# EAGLE design almo (EAGLE 9.4.2)
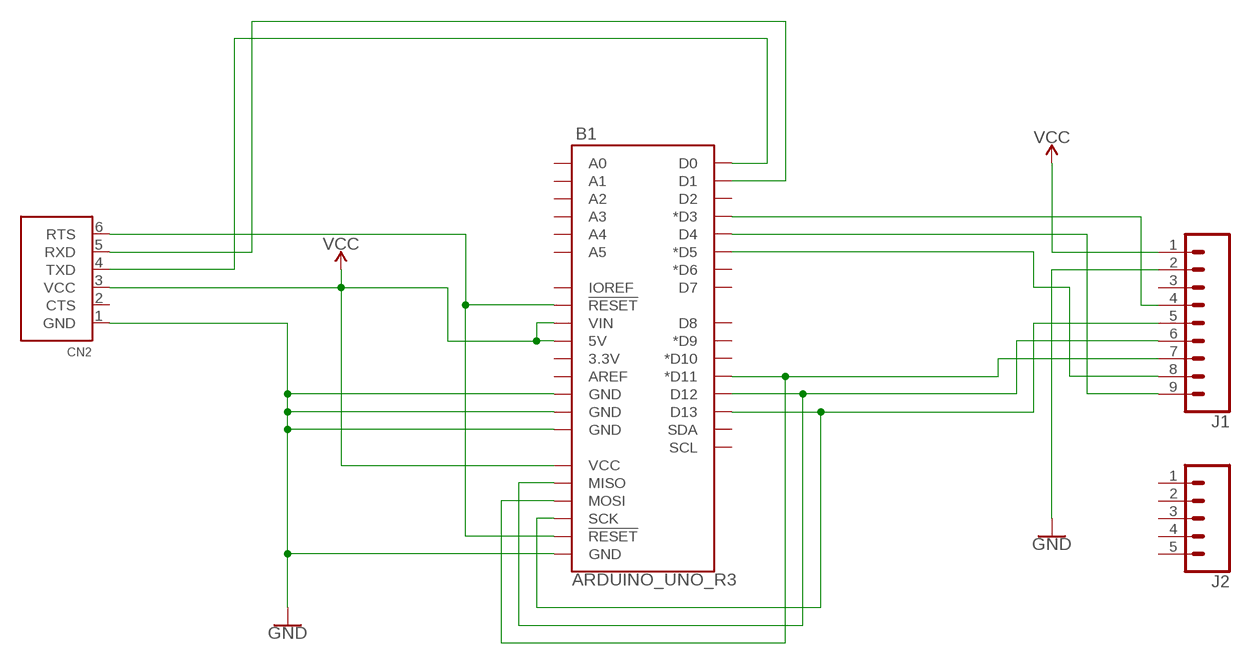
[diagram p0: schematic, sheet 1]

## Parts
B1  ARDUINO_UNO_R3  [ARDUINO_R3]
CN2  FTDIUSBCABLE  [1X06_ROUND]
J1  CONN_09  [1X09]
J2  CONN_05  [1X05]

## Nets
GND: B1.GND@1(GND) B1.GND@2(GND) B1.GND@3(GND) B1.GND@4(GND) CN2.1(GND) J1.2
N$2: B1.D13 B1.SCK J1.5
N$3: B1.RESET@1(!RESET!) B1.RESET@2(!RESET!) CN2.6(RTS)
N$4: B1.D1 CN2.5(RXD)
N$5: B1.D0 CN2.4(TXD)
N$6: B1.D12 B1.MISO J1.6
N$7: B1.D11(*D11) B1.MOSI J1.7
N$8: B1.D5(*D5) J1.8
N$9: B1.D4 J1.9
N$10: B1.D3(*D3) J1.4
VCC: B1.5V B1.VCC B1.VIN CN2.3(VCC) J1.1
Unconnected: B1.3.3V B1.A0 B1.A1 B1.A2 B1.A3 B1.A4 B1.A5 B1.AREF B1.D2 B1.D6(*D6) B1.D7 B1.D8 B1.D9(*D9) B1.D10(*D10) B1.IOREF B1.SCL B1.SDA CN2.2(CTS) J1.3 J2.1 J2.2 J2.3 J2.4 J2.5

## Library data of the parts
B1 = SparkFun-Boards:ARDUINO_UNO_R3: Arduino R3 Footprint with SPI header Arduino Uno R3 Compatible Footprint. Matches PCB size of the original board. SparkFun Products: SAMD21 Dev Breakout <https://www.sparkfun.com/products/13672> RedBoard <https://www.sparkfun.com/products/12757> R3 Stackable Headers <https://www.sparkfun.com/products/11417>
CN2 = microbuilder:FTDIUSBCABLE: FTDI TTL-232R USB Cable Connector for FTDI's USB->RS232 Cable
J1 = SparkFun-Connectors:CONN_09: Multi connection point. Often used as Generic Header-pin footprint for 0.1 inch spaced/style header connections On any of the 0.1 inch spaced packages, you can populate with these: Break Away Headers - Straight <https://www.sparkfun.com/products/116> (PRT-00116) Break Away Male Headers - Right Angle <https://www.sparkfun.com/products/553> (PRT-00553) Female Headers <https://www.sparkfun.com/products/115> (PRT-00115) Break Away Headers - Machine Pin <https://www.sparkfun.com/products/117> (PRT-00117) Break Away Female Headers - Swiss Machine Pin <https://www.sparkfun.com/products/743> (PRT-00743) For SCREWTERMINALS and SPRING TERMINALS visit here: Screw Terimnals on SparkFun.com <https://www.sparkfun.com/search/results?term=Screw+Terminals> (5mm/3.5mm/2.54mm spacing) This device is also useful as a general connection point to wire up your design to another part of your project. Our various solder wires solder well into these plated through hole pads. Hook-Up Wire - Assortment (Stranded, 22 AWG) <https://www.sparkfun.com/products/11375> (PRT-11375) Hook-Up Wire - Assortment (Solid Core, 22 AWG) <https://www.sparkfun.com/products/11367> (PRT-11367) View the entire wire category on our website here <https://www.sparkfun.com/categories/141> Special notes: Molex polarized connector foot print use with SKU : PRT-08231 with associated crimp pins and housings. 1MM SMD Version SKU: PRT-10208 NOTES ON THE VARIANTS LOCK and LOCK_LONGPADS... This footprint was designed to help hold the alignment of a through-hole component (i.e. 6-pin header) while soldering it into place. You may notice that each hole has been shifted either up or down by 0.005 of an inch from it's more standard position (which is a perfectly straight line). This slight alteration caused the pins (the squares in the middle) to touch the edges of the holes. Because they are alternating, it causes a "brace" to hold the component in place. 0.005 has proven to be the perfect amount of "off-center" position when using our standard breakaway headers. Although looks a little odd when you look at the bare footprint, once you have a header in there, the alteration is very hard to notice. Also,if you push a header all the way into place, it is covered up entirely on the bottom side.
J2 = SparkFun-Connectors:CONN_05: Multi connection point. Often used as Generic Header-pin footprint for 0.1 inch spaced/style header connections On any of the 0.1 inch spaced packages, you can populate with these: Break Away Headers - Straight <https://www.sparkfun.com/products/116> (PRT-00116) Break Away Male Headers - Right Angle <https://www.sparkfun.com/products/553> (PRT-00553) Female Headers <https://www.sparkfun.com/products/115> (PRT-00115) Break Away Headers - Machine Pin <https://www.sparkfun.com/products/117> (PRT-00117) Break Away Female Headers - Swiss Machine Pin <https://www.sparkfun.com/products/743> (PRT-00743) For SCREWTERMINALS and SPRING TERMINALS visit here: Screw Terimnals on SparkFun.com <https://www.sparkfun.com/search/results?term=Screw+Terminals> (5mm/3.5mm/2.54mm spacing) This device is also useful as a general connection point to wire up your design to another part of your project. Our various solder wires solder well into these plated through hole pads. Hook-Up Wire - Assortment (Stranded, 22 AWG) <https://www.sparkfun.com/products/11375> (PRT-11375) Hook-Up Wire - Assortment (Solid Core, 22 AWG) <https://www.sparkfun.com/products/11367> (PRT-11367) View the entire wire category on our website here <https://www.sparkfun.com/categories/141> Special notes: Molex polarized connector foot print use with SKU : PRT-08231 with associated crimp pins and housings. 1MM SMD Version SKU: PRT-10208

## Net classes
0 default: width 0.254 mm, drill 0.508 mm, clearance 0.254 mm

## Board
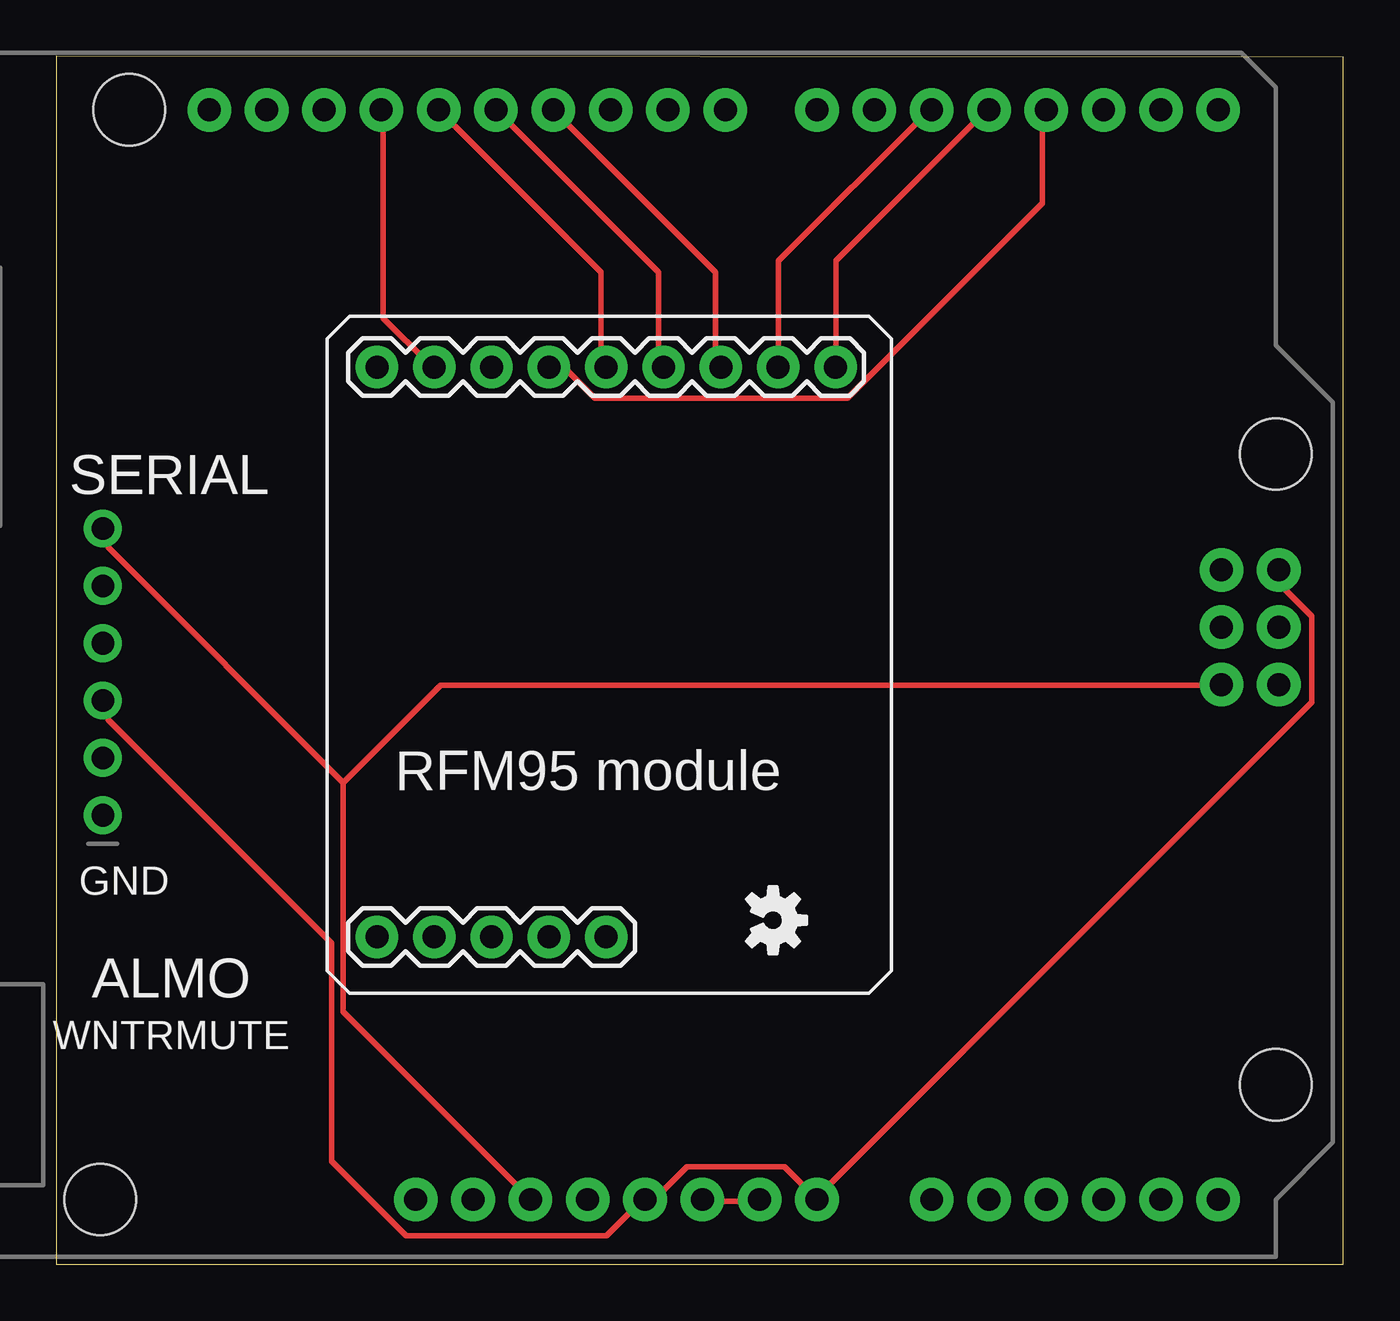
[diagram p1: board, top side]
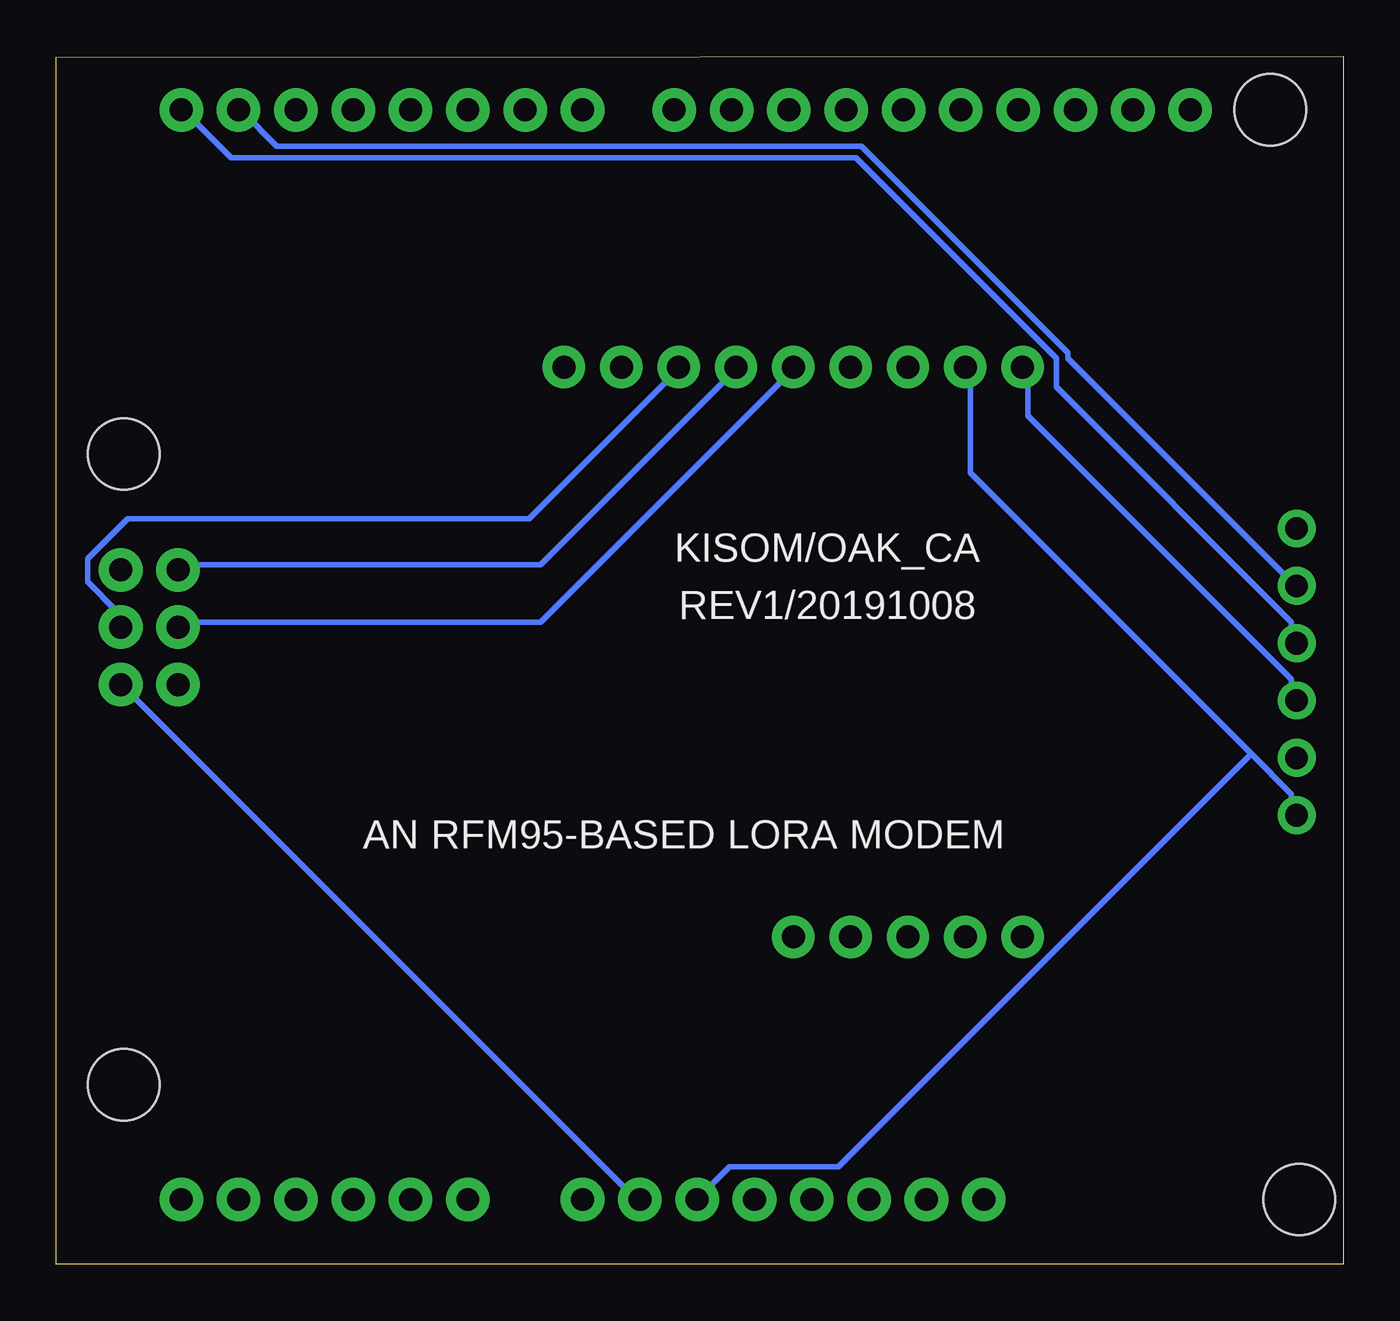
[diagram p2: board, bottom side, seen from below]

Size 57.01 x 53.5 mm. Coordinates in mm from the lower left corner, seen from the top.
Outline: 0,0 57.01,0 57.01,53.46 0,53.5 0,0
Copper layers (1*16): Top 0.035mm / dielectric 1.5mm / Bottom 0.035mm
Design rules "default": minimum track width 6mil, minimum drill 0.35mm, track to track 6mil, track to pad 6mil, pad to pad 6mil, via to via 6mil, smd to smd 6mil, copper to edge 40mil, drill to drill 6mil, minimum pad ring 10mil, minimum via ring 8mil, stop-mask expansion 4mil, vias tented up to drill 0mil, thermal gap 10mil

### Footprints (pad centres in the part's own frame; a part is rotated, then mirrored left to right if it is on the bottom)
ARDUINO_R3 = drill 1.016 pad 1.93: 3.3V 2.54,-24.13; 5V 5.08,-24.13; A0 17.78,-24.13; A1 20.32,-24.13; A2 22.86,-24.13; A3 25.4,-24.13; A4 27.94,-24.13; A5 30.48,-24.13; AREF -9.144,24.13; D0 30.48,24.13; D1 27.94,24.13; D2 25.4,24.13; D3 22.86,24.13; D4 20.32,24.13; D5 17.78,24.13; D6 15.24,24.13; D7 12.7,24.13; D8 8.636,24.13; D9 6.096,24.13; D10 3.556,24.13; D11 1.016,24.13; D12 -1.524,24.13; D13 -4.064,24.13; GND@1 7.62,-24.13; GND@2 10.16,-24.13; GND@3 -6.604,24.13; GND@4 33.16,-1.32; IOREF -2.54,-24.13; MISO 30.62,3.76; MOSI 33.16,1.22; NC -5.08,-24.13; RESET@1 0,-24.13; RESET@2 30.62,-1.32; SCK 30.62,1.22; SCL -14.224,24.13; SDA -11.684,24.13; VCC 33.16,3.76; VIN 12.7,-24.13 | hole 3.175: -17.78,24.13; 33.02,8.89; 33.02,-19.05; -19.05,-24.13
1X06_ROUND = drill 1 pad 1.676: 1 -6.35,0; 2 -3.81,0; 3 -1.27,0; 4 1.27,0; 5 3.81,0; 6 6.35,0
1X09 = drill 1.016 pad 1.88: 1 0,0; 2 2.54,0; 3 5.08,0; 4 7.62,0; 5 10.16,0; 6 12.7,0; 7 15.24,0; 8 17.78,0; 9 20.32,0
1X05 = drill 1.016 pad 1.88: 1 0,0; 2 2.54,0; 3 5.08,0; 4 7.62,0; 5 10.16,0

### Placement (x,y rotation side)
B1  21,27 0 top
CN2  2.05,26.24 90 top
J1  14.2,39.74 0 top
J2  14.2,14.5 0 top
U$1  [OSHW-LOGO-S]  31.75,15.24 270 top

### Tracks (layer width: path | path; a pad name or v marks a point on that pad's centre or on a via)
GND
  Top 0.254: B1.GND@3 14.48,51.05 14.48,41.91 16.51,39.88 J1.2 | B1.GND@1 28.7,2.79 30.99,2.79 B1.GND@2
  Bottom 0.254: 4.06,22.61 16.51,35.05 16.51,39.62 J1.2 | 4.06,22.61 2.29,20.83 2.29,20.07 CN2.1 | B1.GND@4 54.1,25.65 31.24,2.79 B1.GND@2 | 4.06,22.61 22.35,4.32 27.18,4.32 28.45,3.05 B1.GND@1
N$2
  Top 0.254: J1.5 24.13,39.88 24.13,43.94 17.02,51.05 B1.D13
  Bottom 0.254: B1.SCK 51.56,28.45 35.56,28.45 24.38,39.62 J1.5
N$3
  Top 0.254: 12.7,21.34 2.29,31.75 2.29,32.51 CN2.6 | 12.7,21.34 12.7,11.18 20.83,3.05 B1.RESET@1 | 12.7,21.34 17.02,25.65 51.56,25.65 B1.RESET@2
N$4
  Bottom 0.254: CN2.5 2.29,30.23 12.19,40.13 12.19,40.39 21.34,49.53 47.24,49.53 48.77,51.05 B1.D1
N$5
  Bottom 0.254: CN2.4 2.29,27.69 2.29,28.45 12.7,38.86 12.7,40.13 21.59,49.02 49.28,49.02 51.31,51.05 B1.D0
N$6
  Top 0.254: J1.6 26.67,39.88 26.67,43.94 19.56,51.05 B1.D12
  Bottom 0.254: B1.MISO 51.56,30.99 35.56,30.99 26.92,39.62 J1.6
N$7
  Top 0.254: J1.7 29.21,39.88 29.21,43.94 22.1,51.05 B1.D11
  Bottom 0.254: B1.MOSI 54.36,28.45 54.36,28.96 55.63,30.23 55.63,31.24 53.85,33.02 36.07,33.02 29.46,39.62 J1.7
N$8
  Top 0.254: J1.8 32,39.88 32,44.45 38.61,51.05 B1.D5
N$9
  Top 0.254: J1.9 34.54,39.88 34.54,44.45 41.15,51.05 B1.D4
N$10
  Top 0.254: J1.4 21.84,39.62 22.61,39.62 23.88,38.35 35.05,38.35 43.69,46.99 43.69,51.05 B1.D3
VCC
  Top 0.254: B1.VCC 54.36,30.73 54.36,29.97 55.63,28.7 55.63,24.89 33.78,3.05 B1.VIN 33.53,3.05 32.26,4.32 27.94,4.32 26.67,3.05 26.16,3.05 B1.5V 25.91,2.79 24.38,1.27 15.49,1.27 12.19,4.57 12.19,14.22 2.29,24.13 2.29,24.89 CN2.3
  Bottom 0.254: CN2.3 2.29,25.15 2.29,25.91 13.97,37.59 13.97,39.62 J1.1

### Text on the board
tPlace: SERIAL | RFM95 module | GND | ALMO | WNTRMUTE
bPlace: KISOM/OAK_CA | REV1/20191008 | AN RFM95-BASED LORA MODEM